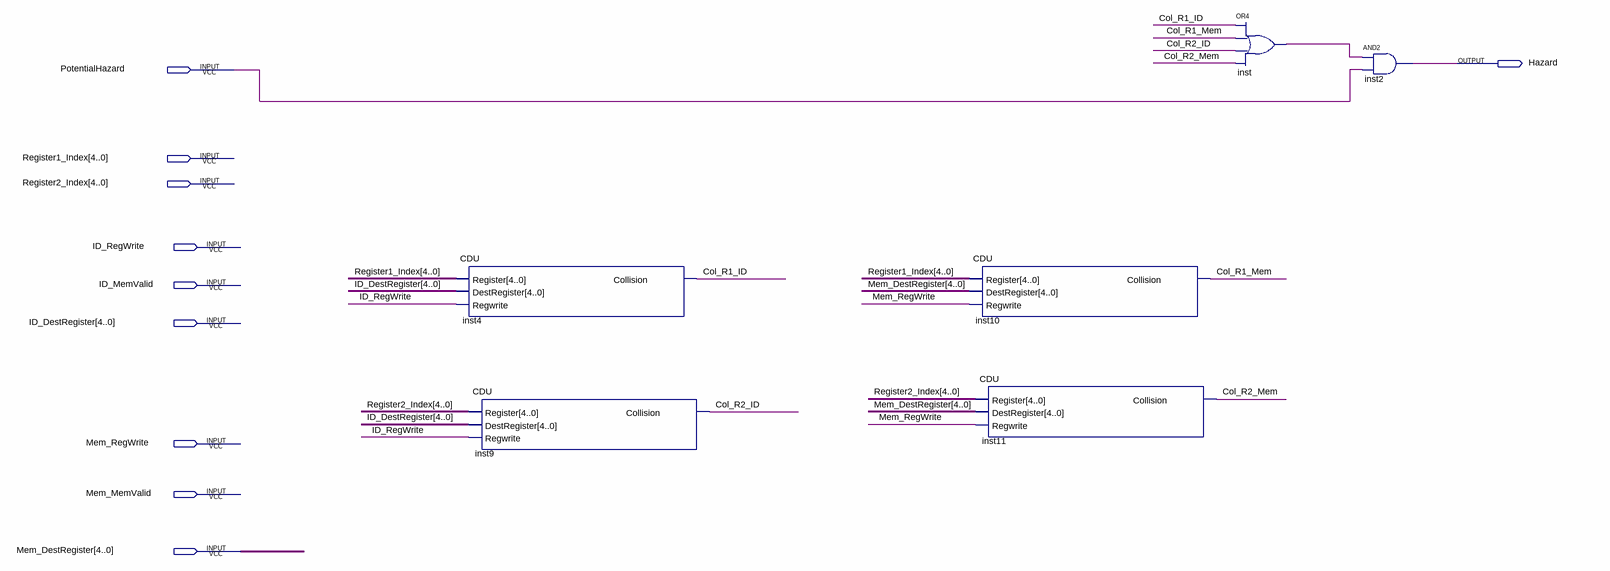
[diagram p0: schematic sheet]
// Quartus schematic HDU.bdf as structural Verilog: 6 symbols, 10 pins
module HDU (
  input  PotentialHazard,
  input  [4:0] Register1_Index,
  input  [4:0] Register2_Index,
  input  ID_RegWrite,
  input  ID_MemValid,
  input  [4:0] ID_DestRegister,
  input  Mem_RegWrite,
  input  Mem_MemValid,
  input  [4:0] Mem_DestRegister,
  output Hazard
);

  wire Col_R1_ID, Col_R1_Mem, Col_R2_ID, Col_R2_Mem, inst_out;

  CDU inst4 (.Register(Register1_Index), .DestRegister(ID_DestRegister), .Regwrite(ID_RegWrite), .Collision(Col_R1_ID));
  CDU inst9 (.Register(Register2_Index), .DestRegister(ID_DestRegister), .Regwrite(ID_RegWrite), .Collision(Col_R2_ID));
  CDU inst10 (
    .Register(Register1_Index), .DestRegister(Mem_DestRegister), .Regwrite(Mem_RegWrite),
    .Collision(Col_R1_Mem));
  CDU inst11 (
    .Register(Register2_Index), .DestRegister(Mem_DestRegister), .Regwrite(Mem_RegWrite),
    .Collision(Col_R2_Mem));
  or inst (inst_out, Col_R1_ID, Col_R1_Mem, Col_R2_ID, Col_R2_Mem);
  and inst2 (Hazard, inst_out, PotentialHazard);
endmodule
